# Altium schematic sheet main.SchDoc: Main schematic
size A4; Author: HappyDonuts; Revision: 1.0; SheetNumber: 1; SheetTotal: 1
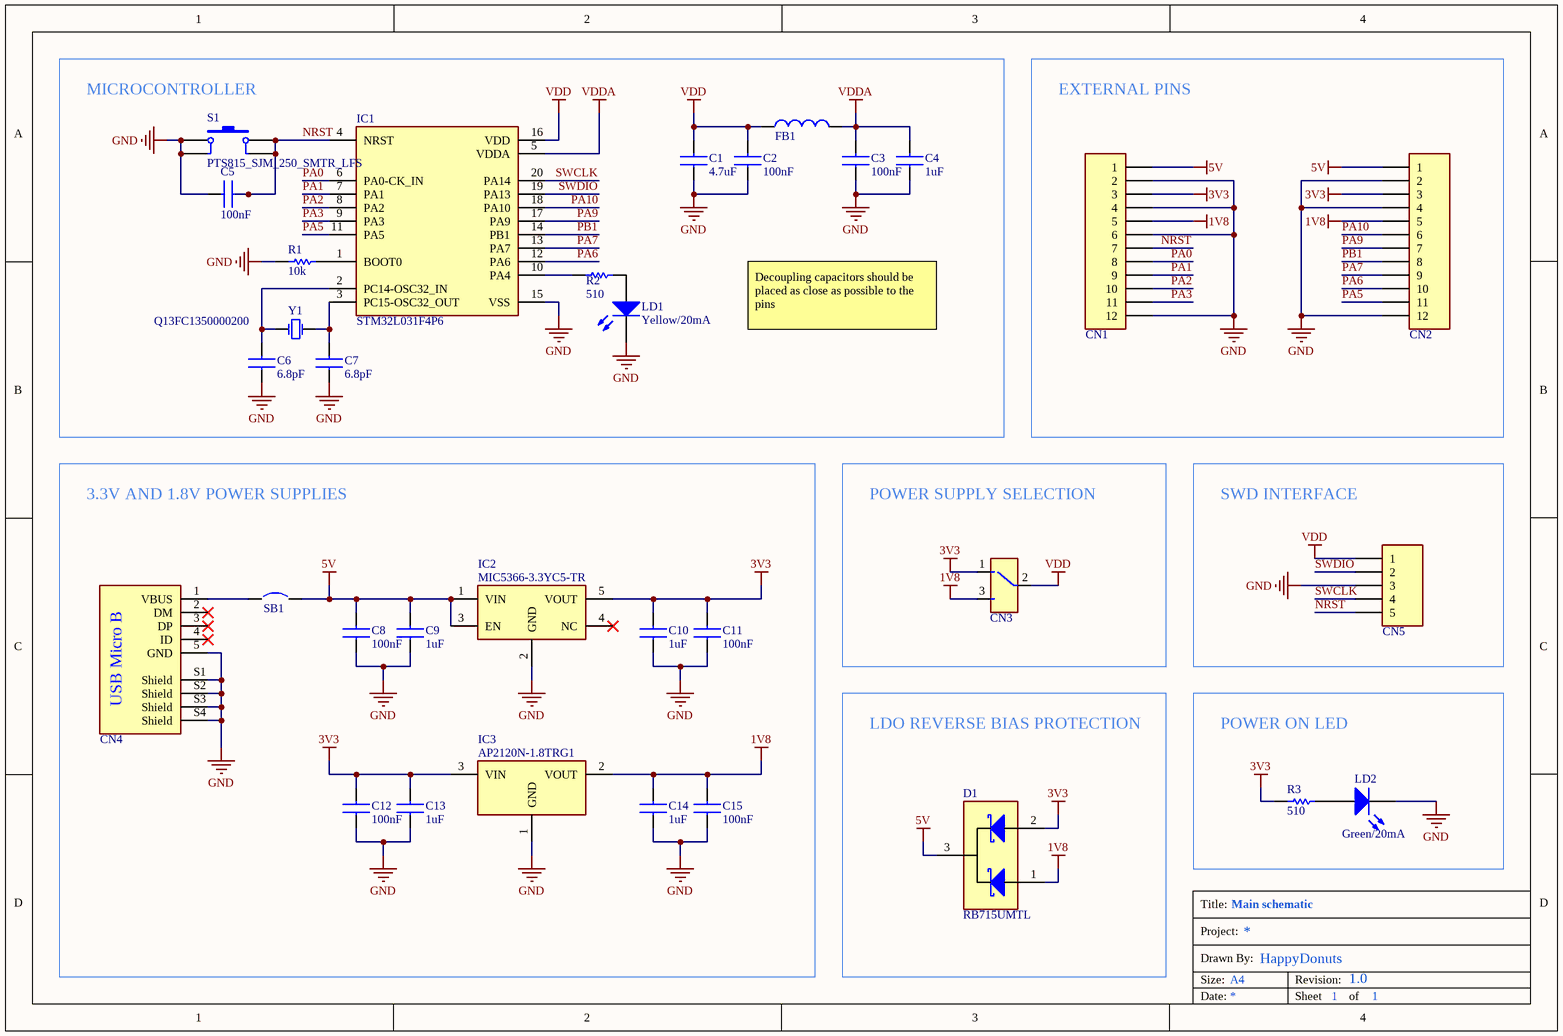
[diagram p0: main.SchDoc]

## Parts
C1  value 4.7uF  [CAPC2012X135N]  (hidden comment: CL21A475KBQNNNE)
C2  value 100nF  [CAPC2012X94N]  (hidden comment: CL21B104KBCNNNC)
C3  value 100nF  [CAPC2012X94N]  (hidden comment: CL21B104KBCNNNC)
C4  value 1uF  [CAPC2012X135N]  (hidden comment: CL21B105KBFNNNE)
C5  value 100nF  [CAPC2012X94N]  (hidden comment: CL21B104KBCNNNC)
C6  value 6.8pF  [CAPC2012X94N]  (hidden comment: CC0805CRNPO9BN6R8)
C7  value 6.8pF  [CAPC2012X94N]  (hidden comment: CC0805CRNPO9BN6R8)
C8  value 100nF  [CAPC2012X94N]  (hidden comment: CL21B104KBCNNNC)
C9  value 1uF  [CAPC2012X135N]  (hidden comment: CL21B105KBFNNNE)
C10  value 1uF  [CAPC2012X135N]  (hidden comment: CL21B105KBFNNNE)
C11  value 100nF  [CAPC2012X94N]  (hidden comment: CL21B104KBCNNNC)
C12  value 100nF  [CAPC2012X94N]  (hidden comment: CL21B104KBCNNNC)
C13  value 1uF  [CAPC2012X135N]  (hidden comment: CL21B105KBFNNNE)
C14  value 1uF  [CAPC2012X135N]  (hidden comment: CL21B105KBFNNNE)
C15  value 100nF  [CAPC2012X94N]  (hidden comment: CL21B104KBCNNNC)
CN1  CN_12PIN  [CN_12PIN]  (value not drawn)
CN2  CN_12PIN  [CN_12PIN]  (value not drawn)
CN3  CN_3PIN  [CN_3PIN]  (value not drawn)
CN4  USB_B_AE  [USB_B_AE]  (value not drawn)
CN5  CN_5PIN  [CN_5PIN]  (value not drawn)
D1  RB715UMTL  [DAN217UMTL]
FB1  FBMJ2125HS250NT  [BEADC2012X105N]  (value not drawn)
IC1  STM32L031F4P6  [SOP65P640X120-20N]
IC2  MIC5366-3.3YC5-TR  [SOT65P210X110-5N]
IC3  AP2120N-1.8TRG1  [SOT95P230X110-3N]
LD1  value Yellow/20mA  [LEDC2012X85N_Y]  (hidden comment: LTST-C171KSKT)
LD2  value Green/20mA  [LEDC2012X85N_G]  (hidden comment: LTST-C171KGKT)
R1  value 10k  [RESC2012X60N]  (hidden comment: RC0805FR-0710KL)
R2  value 510  [RESC2012X60N]  (hidden comment: RC0805FR-07510RL)
R3  value 510  [RESC2012X60N]  (hidden comment: RC0805FR-07510RL)
S1  PTS815_SJM_250_SMTR_LFS  [PTS815SJM250SMTRLFS]
SB1  RC0805FR-070RL  [RESC2012X60N]  (value not drawn)
Y1  Q13FC1350000200  [Q13FC1350000200]

## Blocks framed on the sheet
MICROCONTROLLER: C1-C7 FB1 IC1 LD1 R1 R2 S1 Y1
EXTERNAL PINS: CN1 CN2
POWER SUPPLY SELECTION: CN3
SWD INTERFACE: CN5
LDO REVERSE BIAS PROTECTION: D1
POWER ON LED: LD2 R3

## Nets
1V8: C14.2 C15.2 CN1.5 CN2.5 CN3.3 D1.1(K_1) IC3.2(VOUT)
3V3: C10.2 C11.2 C12.2 C13.2 CN1.3 CN2.3 CN3.1 D1.2(K_2) IC2.5(VOUT) IC3.3(VIN) R3.2
5V: C8.2 C9.2 CN1.1 CN2.1 D1.3(COM_A) IC2.1(VIN) IC2.3(EN) SB1.2
GND: C1.2 C2.1 C3.1 C4.1 C5.2 C6.1 C7.1 C8.1 C9.1 C10.1 C11.1 C12.1 C13.1 C14.1 C15.1 CN1.2 CN1.4 CN1.6 CN1.12 CN2.2 CN2.4 CN2.12 CN4.5(GND) CN4.S1(Shield) CN4.S2(Shield) CN4.S3(Shield) CN4.S4(Shield) CN5.3 IC1.15(VSS) IC2.2(GND) IC3.1(GND) LD1.1(K) LD2.1(K) R1.1 S1.1 S1.2
VDD: C1.1 C2.2 CN3.2 CN5.1 FB1.1 IC1.16(VDD)
VDDA: C3.2 C4.2 FB1.2 IC1.5(VDDA)
NRST: C5.1 CN1.7 CN5.5 IC1.4(NRST) S1.3 S1.4
PA0: CN1.8 IC1.6(PA0-CK_IN)
PA1: CN1.9 IC1.7(PA1)
PA2: CN1.10 IC1.8(PA2)
PA3: CN1.11 IC1.9(PA3)
PA5: CN2.11 IC1.11(PA5)
PA6: CN2.10 IC1.12(PA6)
PA7: CN2.9 IC1.13(PA7)
PA9: CN2.7 IC1.17(PA9)
PA10: CN2.6 IC1.18(PA10)
PB1: CN2.8 IC1.14(PB1)
SWCLK: CN5.4 IC1.20(PA14)
SWDIO: CN5.2 IC1.19(PA13)
NetC6_2: C6.2 IC1.2(PC14-OSC32_IN) Y1.1
NetC7_2: C7.2 IC1.3(PC15-OSC32_OUT) Y1.2
NetCN4_1: CN4.1(VBUS) SB1.1
NetIC1_1: IC1.1(BOOT0) R1.2
NetIC1_10: IC1.10(PA4) R2.1
NetLD1_2: LD1.2(A) R2.2
NetLD2_2: LD2.2(A) R3.1

Not connected (* = marked no-connect by the designer): CN4 2(DM)* 3(DP)* 4(ID)*; IC2 4(NC)*

## Notes on the sheet
- Decoupling capacitors should be placed as close as possible to the pins
- 3.3V AND 1.8V POWER SUPPLIES
- USB Micro B
- Title:
- Size:
- Date:
- Drawn By:
- Project:
- A4
- Revision:
- Sheet
- of

## Library data of the parts
C1 = CL21A475KBQNNNE: Capacitor; Manufacturer_Name: Samsung Electro-Mechanics; Datasheet Link: https://www.mouser.fr/datasheet/2/585/MLCC-1837944.pdf; Height: 1.35mm; Manufacturer_Part_Number: CL21A475KBQNNNE; Mouser Part Number: 187-CL21A475KBQNNNE
C2 C3 C5 C8 C11 C12 C15 = CL21B104KBCNNNC: Capacitor; Manufacturer_Name: Samsung Electro-Mechanics; Datasheet Link: https://datasheet.datasheetarchive.com/originals/distributors/Datasheets_SAMA/86a3eaf0882763ef32124d5901f9b833.pdf; Height: 0.95mm; Manufacturer_Part_Number: CL21B104KBCNNNC; Mouser Part Number: 187-CL21B104KBCNNNC; Mouser Price/Stock: https://www.mouser.co.uk/ProductDetail/Samsung-Electro-Mechanics/CL21B104KBCNNNC?qs=349EhDEZ59pEfpnm5yBEmQ%3D%3D; Arrow Part Number: CL21B104KBCNNNC; Arrow Price/Stock: https://www.arrow.com/en/products/cl21b104kbcnnnc/samsung-electro-mechanics?region=europe
C4 C9 C10 C13 C14 = CL21B105KBFNNNE: Capacitor; Manufacturer_Name: Samsung Electro-Mechanics; Datasheet Link: https://componentsearchengine.com/Datasheets/2/CL21B105KBFNNNE.pdf; Height: 1.35mm; Manufacturer_Part_Number: CL21B105KBFNNNE; Mouser Part Number: 187-CL21B105KBFNNNE; Mouser Price/Stock: https://www.mouser.co.uk/ProductDetail/Samsung-Electro-Mechanics/CL21B105KBFNNNE?qs=yOVawPpwOwmddQEBPU6Y9A%3D%3D; Arrow Part Number: CL21B105KBFNNNE; Arrow Price/Stock: https://www.arrow.com/en/products/cl21b105kbfnnne/samsung-electro-mechanics?region=europe
C6 C7 = CC0805CRNPO9BN6R8: Capacitor; Manufacturer_Name: YAGEO (PHYCOMP); Datasheet Link: https://componentsearchengine.com/Datasheets/1/CC0805CRNPO9BN6R8.pdf; Height: 0.7mm; Manufacturer_Part_Number: CC0805CRNPO9BN6R8; Mouser Part Number: 603-CC805CRNPO9BN6R8; Mouser Price/Stock: https://www.mouser.co.uk/ProductDetail/YAGEO/CC0805CRNPO9BN6R8?qs=5q%252BqlK8CmJQXpKtionjueA%3D%3D
CN1 CN2 = CN_12PIN: Connector
CN3 = CN_3PIN: Connector
CN4 = USB_B_AE: USB connector; Manufacturer_Name: XKB Connectivity; Datasheet Link: https://datasheet.lcsc.com/lcsc/2003201905_XKB-Connectivity-U254-051T-4BH83-S1S_C319160.pdf; Mouser Price/Stock: https://www.mouser.co.uk/ProductDetail/Toshiba/TB67H450FNGEL?qs=h6V4JsTaLXeReNg2bp0jug%3D%3D; Arrow Part Number: TB67H450FNG,EL; Arrow Price/Stock: https://www.arrow.com/en/products/tb67h450fngel/toshiba?region=nac
CN5 = CN_5PIN: Connector
D1 = RB715UMTL: Schottky Diode; Manufacturer_Name: ROHM Semiconductor; Datasheet Link: http://uk.rs-online.com/web/p/products/1835297; Height: 1mm; Manufacturer_Part_Number: RB715UMTL; Mouser Part Number: 755-RB715UMTL; Mouser Price/Stock: https://www.mouser.co.uk/ProductDetail/ROHM-Semiconductor/RB715UMTL?qs=HXFqYaX1Q2wTXMfu8QxCQg%3D%3D
FB1 = FBMJ2125HS250NT: Ferrite Bead; Manufacturer_Name: TAIYO YUDEN; Value: 25Ohms/4mOhms; Datasheet Link: https://mouser.componentsearchengine.com/Datasheets/1/FBMJ2125HS250NT.pdf; Height: 1.05mm; Manufacturer_Part_Number: FBMJ2125HS250NT; Mouser Part Number: 963-FBMJ2125HS250NT; Mouser Price/Stock: https://www.mouser.co.uk/ProductDetail/Taiyo-Yuden/FBMJ2125HS250NT?qs=I6KAKw0tg2w%2F7qNkMvc%2FCQ%3D%3D; Arrow Part Number: FBMJ2125HS250NT; Arrow Price/Stock: https://www.arrow.com/en/products/fbmj2125hs250nt/taiyo-yuden
IC1 = STM32L031F4P6: Integrated Circuit; Manufacturer_Name: STMicroelectronics; Datasheet Link: http://www.st.com/resource/en/datasheet/stm32l031f4.pdf; Height: 1.2mm; Manufacturer_Part_Number: STM32L031F4P6; Mouser Part Number: 511-STM32L031F4P6; Mouser Price/Stock: https://www.mouser.co.uk/ProductDetail/STMicroelectronics/STM32L031F4P6?qs=dTJS0cRn7ohU%2FRoH6ms1pg%3D%3D; Arrow Part Number: STM32L031F4P6; Arrow Price/Stock: https://www.arrow.com/en/products/stm32l031f4p6/stmicroelectronics
IC2 = MIC5366-3.3YC5-TR: LDO; Manufacturer_Name: Microchip; Value: 3.3V/150mA; Datasheet Link: http://www.mouser.com/ds/2/268/mic5365-779177.pdf; Height: 1.1mm; Manufacturer_Part_Number: MIC5366-3.3YC5-TR; Mouser Part Number: 998-MIC5366-3.3YC5TR; Mouser Price/Stock: https://www.mouser.co.uk/ProductDetail/Microchip-Technology-Micrel/MIC5365-33YC5-TR?qs=U6T8BxXiZAXvJj%252BPZ%252B301w%3D%3D; Arrow Part Number: MIC5366-3.3YC5-TR; Arrow Price/Stock: https://www.arrow.com/en/products/mic5365-3.3yc5-tr/microchip-technology?region=nac
IC3 = AP2120N-1.8TRG1: LDO; Manufacturer_Name: Diodes Inc.; Value: 1.8V/150mA; Datasheet Link: https://datasheet.datasheetarchive.com/originals/distributors/Datasheets_SAMA/eefff3041187ea13496cd4a0771f8fec.pdf; Height: 1.1mm; Manufacturer_Part_Number: AP2120N-1.8TRG1; Mouser Part Number: 621-AP2120N-1.8TRG1; Mouser Price/Stock: https://www.mouser.co.uk/ProductDetail/Diodes-Incorporated/AP2120N-18TRG1?qs=x6A8l6qLYDC3T4tUK6BUJA%3D%3D; Arrow Part Number: AP2120N-1.8TRG1; Arrow Price/Stock: https://www.arrow.com/en/products/ap2120n-1.8trg1/diodes-incorporated
LD1 = LTST-C171KSKT: LED; Manufacturer_Name: Lite-On; Datasheet Link: https://componentsearchengine.com/Datasheets/1/LTST-C171KSKT.pdf; Height: 0.9mm; Manufacturer_Part_Number: LTST-C171KSKT; Mouser Part Number: 859-LTST-C171KSKT; Mouser Price/Stock: https://www.mouser.co.uk/ProductDetail/Lite-On/LTST-C171KSKT?qs=llMtm9xcdM0CwR1bByTaUQ%3D%3D; Arrow Part Number: LTST-C171KSKT; Arrow Price/Stock: https://www.arrow.com/en/products/ltst-c171kskt/lite-on-technology?region=nac
LD2 = LTST-C171KGKT: LED; Manufacturer_Name: Lite-On; Datasheet Link: https://optoelectronics.liteon.com/upload/download/DS22-2000-118/LTST-C171KGKT.pdf; Height: 0.9mm; Manufacturer_Part_Number: LTST-C171KGKT; Mouser Part Number: 859-LTST-C171KGKT; Mouser Price/Stock: https://www.mouser.co.uk/ProductDetail/Lite-On/LTST-C171KGKT?qs=j1zysehuyChA38z%2F%252BFfUSw%3D%3D; Arrow Part Number: LTST-C171KGKT; Arrow Price/Stock: https://www.arrow.com/en/products/ltst-c171kgkt/lite-on-technology?region=nac
R1 = RC0805FR-0710KL: Resistor; Manufacturer_Name: YAGEO (PHYCOMP); Datasheet Link: https://datasheet.datasheetarchive.com/originals/distributors/Datasheets_SAMA/902f9e387b938f871d31120f5fc1d65e.pdf; Height: 0.6mm; Manufacturer_Part_Number: RC0805FR-0710KL; Mouser Part Number: 603-RC0805FR-0710KL; Mouser Price/Stock: https://www.mouser.co.uk/ProductDetail/YAGEO/RC0805FR-0710KL?qs=7bY8808IzHq6vrU3BeiiYw%3D%3D; Arrow Part Number: RC0805FR-0710KL; Arrow Price/Stock: https://www.arrow.com/en/products/rc0805fr-0710kl/yageo?region=europe
R2 R3 = RC0805FR-07510RL: Resistor; Manufacturer_Name: YAGEO (PHYCOMP); Datasheet Link: https://datasheet.datasheetarchive.com/originals/distributors/Datasheets_SAMA/902f9e387b938f871d31120f5fc1d65e.pdf; Height: 0.6mm; Manufacturer_Part_Number: RC0805FR-07510RL; Mouser Part Number: 603-RC0805FR-07510RL; Mouser Price/Stock: https://www.mouser.com/Search/Refine.aspx?Keyword=603-RC0805FR-07510RL
S1 = PTS815_SJM_250_SMTR_LFS: Switch; Manufacturer_Name: C & K COMPONENTS; Manufacturer_Part_Number: PTS815 SJM 250 SMTR LFS; Datasheet Link: https://componentsearchengine.com/Datasheets/1/PTS815 SJM 250 SMTR LFS.pdf; Height: 2.7mm; Mouser Part Number: 611-PTS815SJM250SMTR; Mouser Price/Stock: https://www.mouser.co.uk/ProductDetail/CK/PTS815-SJM-250-SMTR-LFS?qs=ahcBuItHZ3xKWmfV%2F2E6bA%3D%3D; Arrow Part Number: PTS815 SJM 250 SMTR LFS; Arrow Price/Stock: https://www.arrow.com/en/products/pts815-sjm-250-smtr-lfs/ck
SB1 = RC0805FR-070RL: Jumper (0 ohm); Manufacturer_Name: YAGEO (PHYCOMP); Datasheet Link: https://datasheet.datasheetarchive.com/originals/distributors/Datasheets_SAMA/902f9e387b938f871d31120f5fc1d65e.pdf; Height: 0.6mm; Manufacturer_Part_Number: RC0805FR-070RL; Mouser Part Number: 603-RC0805FR-070RL; Mouser Price/Stock: https://www.mouser.co.uk/ProductDetail/YAGEO/RC0805FR-070RL?qs=fRxXYNj8ftF6kXqh1XbZJQ%3D%3D
Y1 = Q13FC1350000200: Crystal; Manufacturer_Name: SEIKO EPSON; Value: 32.768kHz/7pF/70kOhms; Datasheet Link: https://datasheet.lcsc.com/szlcsc/Seiko-Epson-Q13FC1350000200_C48615.pdf; Height: 0.9mm; Manufacturer_Part_Number: Q13FC1350000200